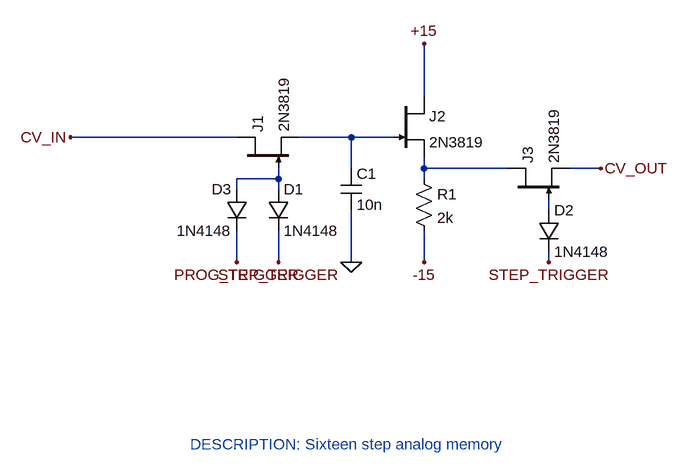
[diagram p0: schematic Brain.asc]
Brain.asc, the LTspice schematic file:
Version 4
SHEET 1 880 680
WIRE 352 -128 352 -208
WIRE 64 -64 -192 -64
WIRE 240 -64 160 -64
WIRE 304 -64 240 -64
WIRE 240 -16 240 -64
WIRE 352 -16 352 -32
WIRE 480 -16 352 -16
WIRE 624 -16 576 -16
WIRE 128 0 128 -16
WIRE 128 0 64 0
WIRE 352 0 352 -16
WIRE 64 16 64 0
WIRE 128 16 128 0
WIRE 544 48 544 32
WIRE 64 128 64 80
WIRE 128 128 128 80
WIRE 240 128 240 48
WIRE 352 128 352 80
WIRE 544 128 544 112
FLAG 352 128 -15
FLAG 352 -208 +15
FLAG 240 128 0
FLAG -192 -64 CV_IN
FLAG 624 -16 CV_OUT
FLAG 128 128 STEP_TRIGGER
FLAG 544 128 STEP_TRIGGER
FLAG 64 128 PROG_TRIGGER
SYMBOL njf 64 -16 R270
SYMATTR InstName J1
SYMATTR Value 2N3819
SYMBOL njf 304 -128 R0
SYMATTR InstName J2
SYMATTR Value 2N3819
SYMBOL res 336 -16 R0
SYMATTR InstName R1
SYMATTR Value 2k
SYMBOL diode 112 16 R0
SYMATTR InstName D1
SYMATTR Value 1N4148
SYMBOL njf 480 32 R270
SYMATTR InstName J3
SYMATTR Value 2N3819
SYMBOL diode 528 48 R0
SYMATTR InstName D2
SYMATTR Value 1N4148
SYMBOL cap 224 -16 R0
SYMATTR InstName C1
SYMATTR Value 10n
SYMBOL diode 80 16 M0
SYMATTR InstName D3
SYMATTR Value 1N4148
TEXT -8 408 Left 0 ;DESCRIPTION: Sixteen step analog memory

The netlist it stands for:
* Brain.asc
J1 CV_IN N003 N001 2N3819
J2 +15 N001 N002 2N3819
R1 N002 -15 2k
D1 N003 STEP_TRIGGER 1N4148
J3 N002 N004 CV_OUT 2N3819
D2 N004 STEP_TRIGGER 1N4148
C1 N001 0 10n
D3 N003 PROG_TRIGGER 1N4148
.model D D
.lib standard.dio
.model NJF NJF
.model PJF PJF
.lib standard.jft
* DESCRIPTION: Sixteen step analog memory
.backanno
.end